# Altium schematic sheet STM32F767ZIT6.SchDoc
size A4; Author: Wojciech Grędel; CompanyName: AGH Racing; DocumentNumber: 9; Revision: 1; SheetNumber: 1; SheetTotal: 1
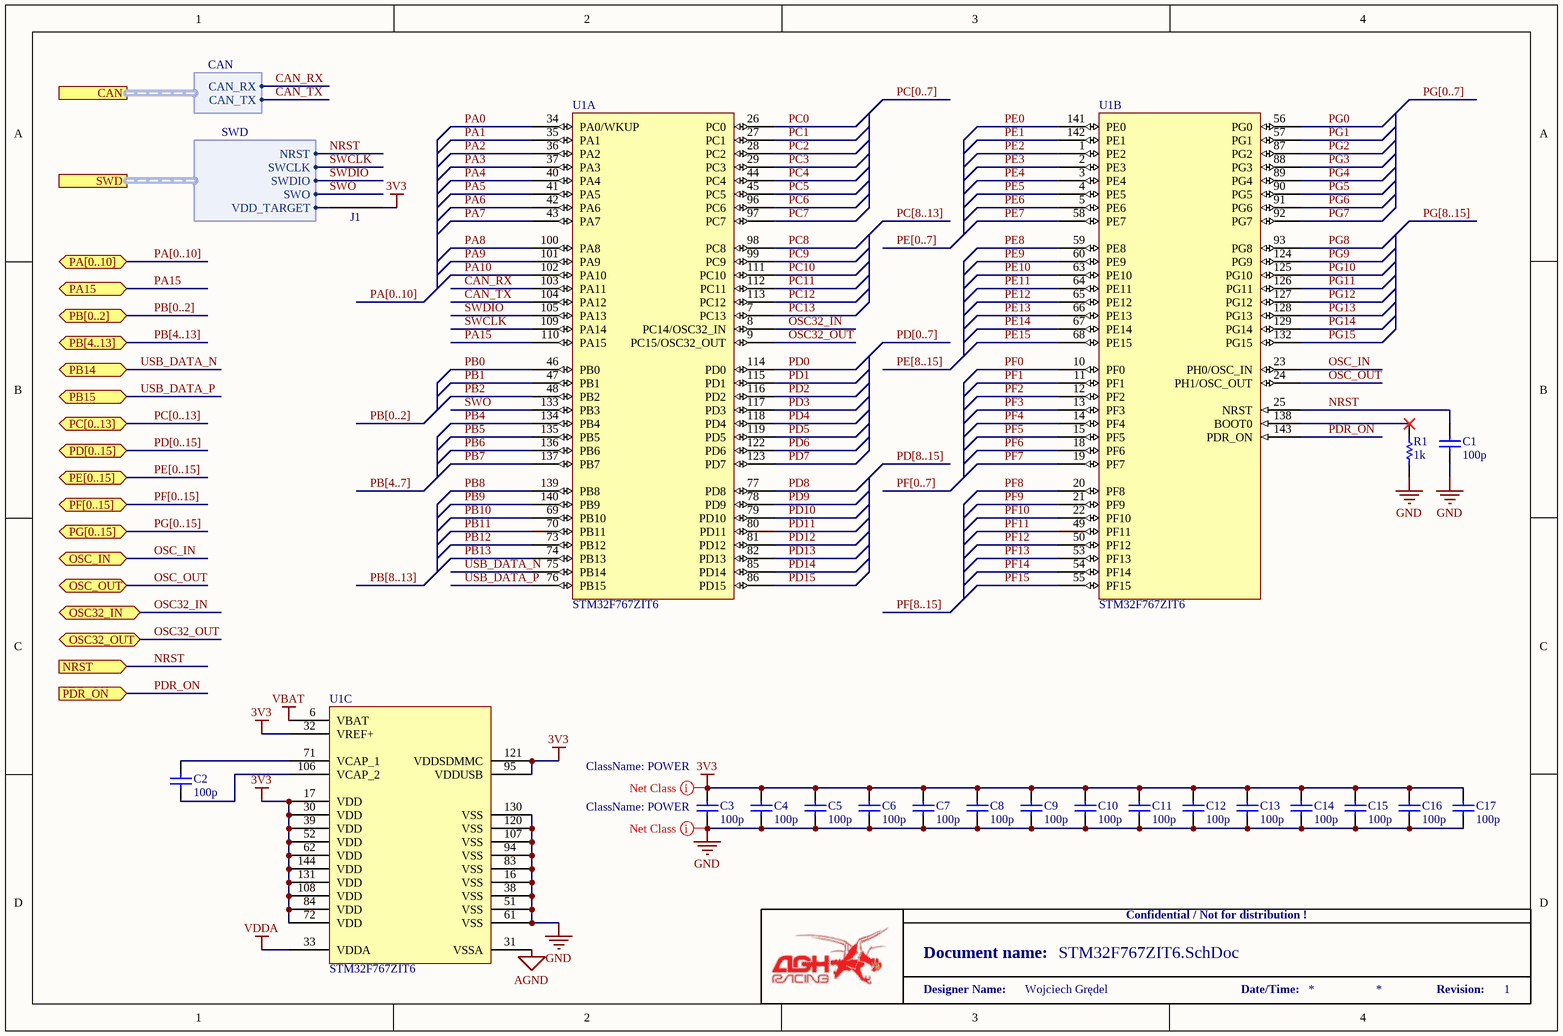
[diagram p0: STM32F767ZIT6.SchDoc]

## Parts
C1  value 100p  [CAP_0603_IPC_MD]  (hidden comment: Cap)
C2  value 100p  [CAP_0603_IPC_MD]  (hidden comment: Cap)
C3  value 100p  [CAP_0603_IPC_MD]  (hidden comment: Cap)
C4  value 100p  [CAP_0603_IPC_MD]  (hidden comment: Cap)
C5  value 100p  [CAP_0603_IPC_MD]  (hidden comment: Cap)
C6  value 100p  [CAP_0603_IPC_MD]  (hidden comment: Cap)
C7  value 100p  [CAP_0603_IPC_MD]  (hidden comment: Cap)
C8  value 100p  [CAP_0603_IPC_MD]  (hidden comment: Cap)
C9  value 100p  [CAP_0603_IPC_MD]  (hidden comment: Cap)
C10  value 100p  [CAP_0603_IPC_MD]  (hidden comment: Cap)
C11  value 100p  [CAP_0603_IPC_MD]  (hidden comment: Cap)
C12  value 100p  [CAP_0603_IPC_MD]  (hidden comment: Cap)
C13  value 100p  [CAP_0603_IPC_MD]  (hidden comment: Cap)
C14  value 100p  [CAP_0603_IPC_MD]  (hidden comment: Cap)
C15  value 100p  [CAP_0603_IPC_MD]  (hidden comment: Cap)
C16  value 100p  [CAP_0603_IPC_MD]  (hidden comment: Cap)
C17  value 100p  [CAP_0603_IPC_MD]  (hidden comment: Cap)
J1  NetTie  [NETTIE]  (value not drawn)  (net tie, no BOM)
R1  value 1k  [RES_0603_IPC_MD]  (hidden comment: Res)
U1  STM32F767ZIT6  [LQFP144_IPC_MD]  (parts A,B,C of 3)

## Ports
CAN (harness CAN), NRST (in), OSC32_IN (bidir), OSC32_OUT (bidir), OSC_IN (bidir), OSC_OUT (bidir), PA15 (bidir), PA[0..10] (bidir), PB14 (bidir), PB15 (bidir), PB[0..2] (bidir), PB[4..13] (bidir), PC[0..13] (bidir), PD[0..15] (bidir), PDR_ON (in), PE[0..15] (bidir), PF[0..15] (bidir), PG[0..15] (bidir), SWD (harness SWD)

## Harnesses
CAN: CAN_RX, CAN_TX
SWD: NRST, SWCLK, SWDIO, SWO, VDD_TARGET

## Nets
3V3: C3.2 C4.2 C5.2 C6.2 C7.2 C8.2 C9.2 C10.2 C11.2 C12.2 C13.2 C14.2 C15.2 C16.2 C17.2 J1.1 U1.17(VDD) U1.30(VDD) U1.32(VREF+) U1.39(VDD) U1.52(VDD) U1.62(VDD) U1.72(VDD) U1.84(VDD) U1.95(VDDUSB) U1.108(VDD) U1.121(VDDSDMMC) U1.131(VDD) U1.144(VDD)
AGND: U1.31(VSSA)
GND: C1.1 C3.1 C4.1 C5.1 C6.1 C7.1 C8.1 C9.1 C10.1 C11.1 C12.1 C13.1 C14.1 C15.1 C16.1 C17.1 R1.1 U1.16(VSS) U1.38(VSS) U1.51(VSS) U1.61(VSS) U1.83(VSS) U1.94(VSS) U1.107(VSS) U1.120(VSS) U1.130(VSS)
VBAT: U1.6(VBAT)
VDDA: U1.33(VDDA)
CAN_RX: U1.103(PA11) ; port CAN.CAN_RX
CAN_TX: U1.104(PA12) ; port CAN.CAN_TX
NRST: C1.2 U1.25(NRST) ; port NRST, port SWD.NRST
OSC32_IN: U1.8(PC14/OSC32_IN) ; port OSC32_IN
OSC32_OUT: U1.9(PC15/OSC32_OUT) ; port OSC32_OUT
OSC_IN: U1.23(PH0/OSC_IN) ; port OSC_IN
OSC_OUT: U1.24(PH1/OSC_OUT) ; port OSC_OUT
PA0: U1.34(PA0/WKUP)
PA1: U1.35(PA1)
PA2: U1.36(PA2)
PA3: U1.37(PA3)
PA4: U1.40(PA4)
PA5: U1.41(PA5)
PA6: U1.42(PA6)
PA7: U1.43(PA7)
PA8: U1.100(PA8)
PA9: U1.101(PA9)
PA10: U1.102(PA10)
PA15: U1.110(PA15) ; port PA15
PB0: U1.46(PB0)
PB1: U1.47(PB1)
PB2: U1.48(PB2)
PB4: U1.134(PB4)
PB5: U1.135(PB5)
PB6: U1.136(PB6)
PB7: U1.137(PB7)
PB8: U1.139(PB8)
PB9: U1.140(PB9)
PB10: U1.69(PB10)
PB11: U1.70(PB11)
PB12: U1.73(PB12)
PB13: U1.74(PB13)
PC0: U1.26(PC0)
PC1: U1.27(PC1)
PC2: U1.28(PC2)
PC3: U1.29(PC3)
PC4: U1.44(PC4)
PC5: U1.45(PC5)
PC6: U1.96(PC6)
PC7: U1.97(PC7)
PC8: U1.98(PC8)
PC9: U1.99(PC9)
PC10: U1.111(PC10)
PC11: U1.112(PC11)
PC12: U1.113(PC12)
PC13: U1.7(PC13)
PD0: U1.114(PD0)
PD1: U1.115(PD1)
PD2: U1.116(PD2)
PD3: U1.117(PD3)
PD4: U1.118(PD4)
PD5: U1.119(PD5)
PD6: U1.122(PD6)
PD7: U1.123(PD7)
PD8: U1.77(PD8)
PD9: U1.78(PD9)
PD10: U1.79(PD10)
PD11: U1.80(PD11)
PD12: U1.81(PD12)
PD13: U1.82(PD13)
PD14: U1.85(PD14)
PD15: U1.86(PD15)
PDR_ON: U1.143(PDR_ON) ; port PDR_ON
PE0: U1.141(PE0)
PE1: U1.142(PE1)
PE2: U1.1(PE2)
PE3: U1.2(PE3)
PE4: U1.3(PE4)
PE5: U1.4(PE5)
PE6: U1.5(PE6)
PE7: U1.58(PE7)
PE8: U1.59(PE8)
PE9: U1.60(PE9)
PE10: U1.63(PE10)
PE11: U1.64(PE11)
PE12: U1.65(PE12)
PE13: U1.66(PE13)
PE14: U1.67(PE14)
PE15: U1.68(PE15)
PF0: U1.10(PF0)
PF1: U1.11(PF1)
PF2: U1.12(PF2)
PF3: U1.13(PF3)
PF4: U1.14(PF4)
PF5: U1.15(PF5)
PF6: U1.18(PF6)
PF7: U1.19(PF7)
PF8: U1.20(PF8)
PF9: U1.21(PF9)
PF10: U1.22(PF10)
PF11: U1.49(PF11)
PF12: U1.50(PF12)
PF13: U1.53(PF13)
PF14: U1.54(PF14)
PF15: U1.55(PF15)
PG0: U1.56(PG0)
PG1: U1.57(PG1)
PG2: U1.87(PG2)
PG3: U1.88(PG3)
PG4: U1.89(PG4)
PG5: U1.90(PG5)
PG6: U1.91(PG6)
PG7: U1.92(PG7)
PG8: U1.93(PG8)
PG9: U1.124(PG9)
PG10: U1.125(PG10)
PG11: U1.126(PG11)
PG12: U1.127(PG12)
PG13: U1.128(PG13)
PG14: U1.129(PG14)
PG15: U1.132(PG15)
SWCLK: U1.109(PA14) ; port SWD.SWCLK
SWDIO: U1.105(PA13) ; port SWD.SWDIO
SWO: U1.133(PB3) ; port SWD.SWO
USB_DATA_N: U1.75(PB14) ; port PB14
USB_DATA_P: U1.76(PB15) ; port PB15
NetC2_1: C2.1 U1.106(VCAP_2)
NetC2_2: C2.2 U1.71(VCAP_1)
NetJ1_2: J1.2 ; port SWD.VDD_TARGET
NetR1_2: R1.2 U1.138(BOOT0)

## Buses and harness runs
bus PA[0..10]
bus PA[0..10] = port PA[0..10]
bus PB[0..2]
bus PB[0..2] = port PB[0..2]
bus PB[4..7]
bus PB[4..13] = port PB[4..13]
bus PB[8..13]
bus PC[0..7]
bus PC[0..13] = port PC[0..13]
bus PC[8..13]
bus PD[0..7]
bus PD[0..15] = port PD[0..15]
bus PD[8..15]
bus PE[0..7]
bus PE[0..15] = port PE[0..15]
bus PE[8..15]
bus PF[0..7]
bus PF[0..15] = port PF[0..15]
bus PF[8..15]
bus PG[0..7]
bus PG[0..15] = port PG[0..15]
bus PG[8..15]

## Layout directives
net class POWER: 3V3, GND

## Notes on the sheet
- Confidential / Not for distribution !
- Document name:
- Designer Name:
- Date/Time:
- Revision:

## Library data of the parts
C1-C17 = Cap: Capacitor
R1 = Res: Resistor
U1 = STM32F767ZIT6: ARM Cortex-M4 32-bit MCU, 2048 KB Flash, 512 KB Internal RAM, 114 I/Os, 144-pin LQFP, -40 to 85 degC, Tray